# Altium project FMC-320U-B3.PrjPcb
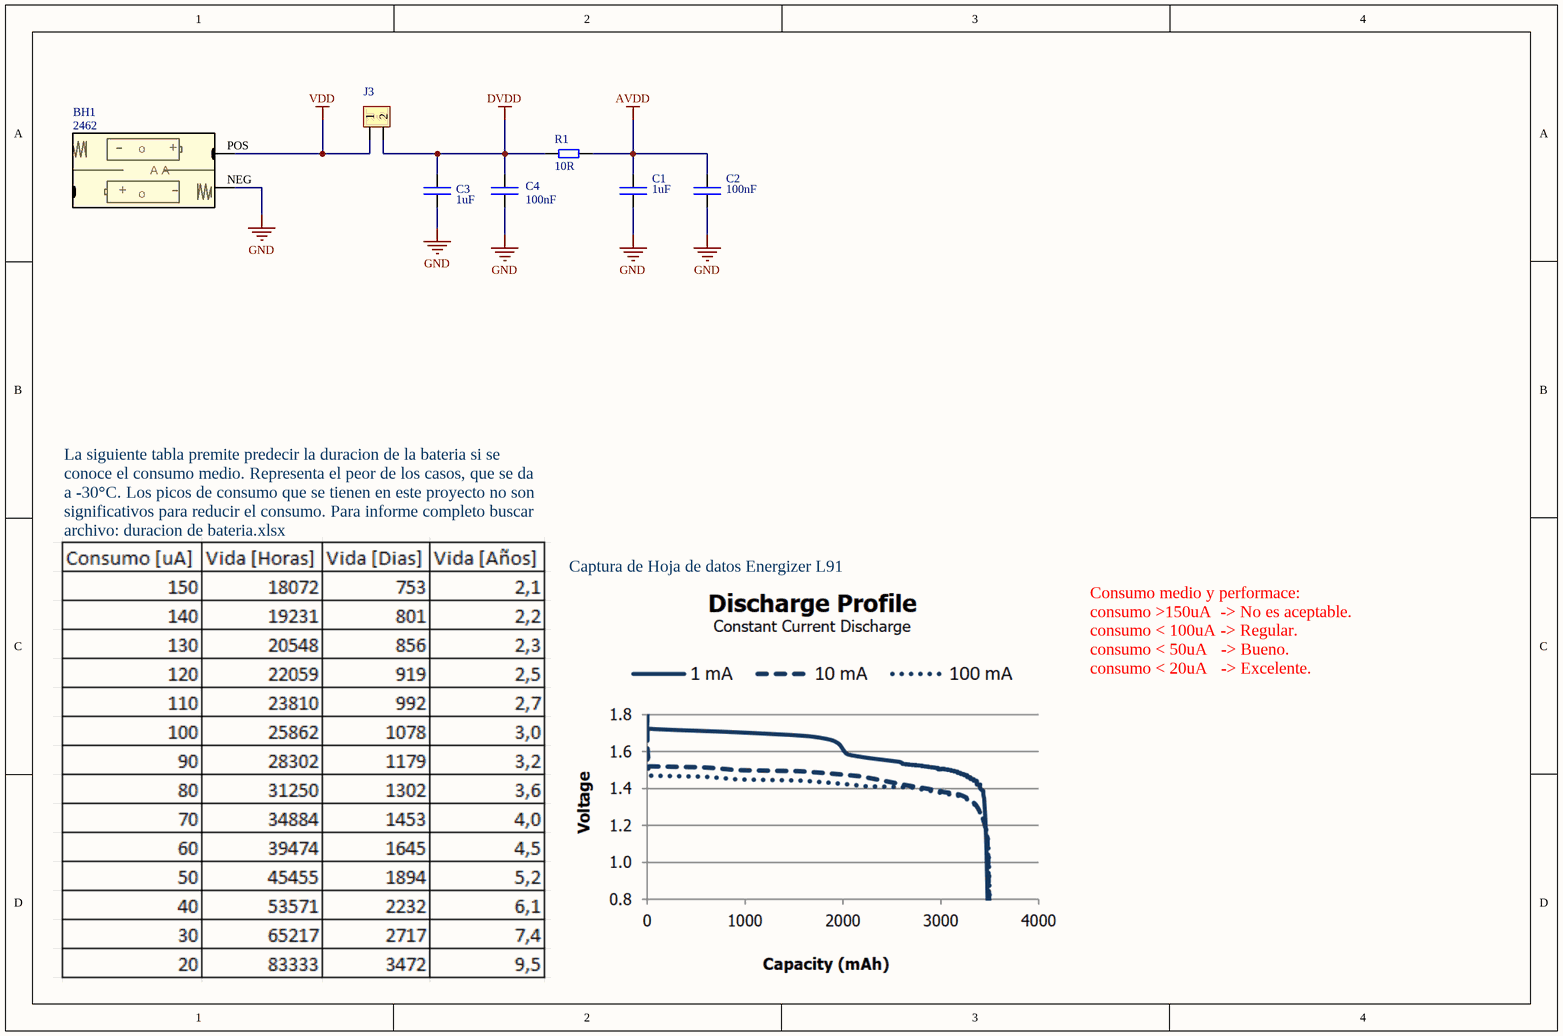
[diagram p0: BatteryMainSystem.SchDoc]
5 sheets, 58 parts. Net scope: flat (ports and power ports of the same name join across sheets).
Board file: FMC-320U-B3.PcbDoc
Sheets:
  BatteryMainSystem.SchDoc
  Interboard.SchDoc
  Fluid_Flow_FE.SchDoc
  Fluid_RTD_FE.SchDoc
  User_Terminal_Block.SchDoc

## Sheet BatteryMainSystem.SchDoc
size A4; SheetNumber: 1; SheetTotal: 4

### Parts
BH1  2462  [BATTERY_HOLDER_2XAA]
C1  1uF  [CAP_SM0603_YAGEOCC2_N]
C2  100nF  [CAP_SM0603_YAGEOCC2_N]
C3  1uF  [CAP_SM0603_YAGEOCC2_N]
C4  100nF  [CAP_SM0603_YAGEOCC2_N]
J3  54101-T0600LF-CUT-2  [HEADER PIN 1X2]  (value not drawn)
R1  10R  [RES_SM0603_YAGEORC_N]

### Nets
AVDD: C1.1 C2.1 R1.2
DVDD: C3.1 C4.1 J3.2 R1.1
GND: BH1.NEG C1.2 C2.2 C3.2 C4.2
VDD: BH1.POS J3.1

### Notes on the sheet
- La siguiente tabla premite predecir la duracion de la bateria si se conoce el consumo medio. Representa el peor de los casos, que se da a -30°C. Los picos de consumo que se tienen en este proyecto no son significativos para reducir el consumo. Para informe completo buscar archivo: duracion de bateria.xlsx
- Captura de Hoja de datos Energizer L91
- Consumo medio y performace:
  consumo >150uA  -> No es aceptable.
  consumo < 100uA -> Regular.
  consumo < 50uA   -> Bueno.
  consumo < 20uA   -> Excelente.
- Title:
- Size: A4
- Date:
- FMC-320U MODEL A
- Sheet:
- Time:
- Of:
- Version:
- Revision:
- Release:
- 1
- 0
- FLOWMEET SRL
- File
- (in symbol 2462) +; A A

### Library data of the parts
BH1 = 2462: Battery holder 2XAA TH; Manufacturer: Keystone; Manufacturer Part Number: 2462; Category: Battery holder; Datasheet: https://www.keyelco.com/userAssets/file/M65p28.pdf; Temperature Max: -; Temperature Min: -
C1 C3 = CC0603KRX7R6BB105: CAP 1uF SM0603 X7R 10V YAGEO CC2; Tolerance (%): 5; Voltage Rating (Volts): 50; Category: Capacitor; Manufacturer: Yageo; Manufacturer Part Number: CC0603KRX7R6BB105; Package: 0603; Value: 1uF; ComponentLink1URL: http://www.yageo.com; ComponentLink1Description: Manufacturer Website; Datasheet: https://datasheet.lcsc.com/lcsc/2304140030_YAGEO-CC0603KRX7R6BB105_C113807.pdf
C2 C4 = CC0603KRX7R9BB104: CAP 100nF SM0603 X7R 50V YAGEO CC2; Tolerance (%): 10; Voltage Rating (Volts): 50; Category: Capacitor; Manufacturer: Yageo; Manufacturer Part Number: CC0603KRX7R9BB104; Package: 0603; Value: 100nF; Supplier Part Number 1: 1362556; Supplier 1: Farnell; ComponentLink1URL: http://www.yageo.com; ComponentLink1Description: Manufacturer Website; Supplier 2: Digi-Key; Supplier Part Number 2: 311-1344-1-ND; Datasheet: https://datasheet.lcsc.com/lcsc/2211101700_YAGEO-CC0603KRX7R9BB104_C14663.pdf
J3 = 54101-T0600LF-CUT-2: Pin header pitch 2.54 TH - cuttable 2 od 36 positions.; Manufacturer: Amphenol ICC; Fraction: 2/36; Manufacturer Part Number: 54101-T0600LF; Vendor: *; Vendor Part Number: *
R1 = RC0603FR-0710RL: RES 10R SM0603 YAGEO RC_L; Power (Watts): 0.1; Resistance (Ohms): 10; Tolerance (%): 1; Category: Resistor; Manufacturer: Yageo; Manufacturer Part Number: RC0603FR-0710RL; Package: 0603; Value: 10R; Supplier Part Number 1: 9238247; Supplier 1: Farnell; ComponentLink1Description: Manufacturer Website; ComponentLink1URL: http://www.yageo.com; Supplier 2: Digi-Key; Supplier Part Number 2: 311-10.0HRCT-ND

## Sheet Interboard.SchDoc
size A4; SheetNumber: 2; SheetTotal: 5
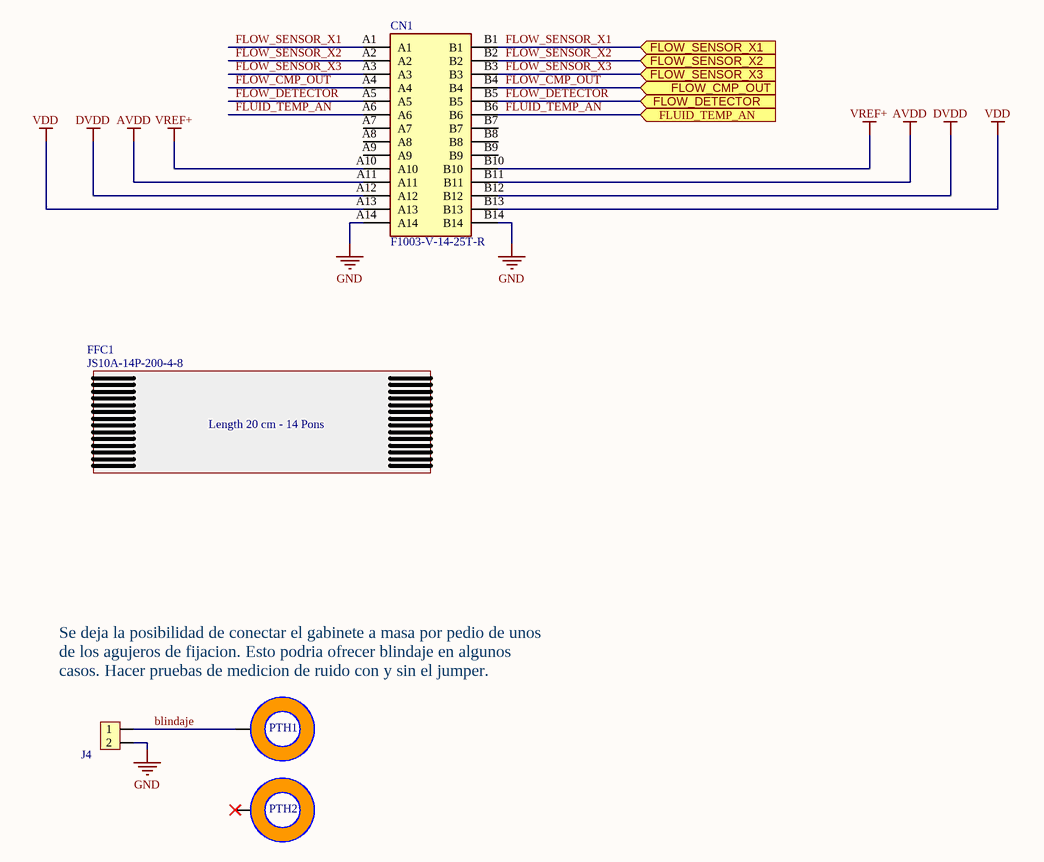
[diagram p1: Interboard.SchDoc]

### Parts
CN1  F1003-V-14-25T-R  [F1003-V-14-25T-R]
FFC1  JS10A-14P-200-4-8  [no_footprint]  (mechanical)
J4  54101-T0600LF-CUT-2  [HEADER PIN 1X2]  (value not drawn)
PTH1  PTH-3MM-L  [PTH_M3_L]  (value not drawn)  (no BOM)
PTH2  PTH-3MM-L  [PTH_M3_L]  (value not drawn)  (no BOM)

### Ports
FLOW_CMP_OUT (in), FLOW_DETECTOR (in), FLOW_SENSOR_X1 (in), FLOW_SENSOR_X2 (in), FLOW_SENSOR_X3 (in), FLUID_TEMP_AN (in)

### Nets
AVDD: CN1.A11 CN1.B11
DVDD: CN1.A12 CN1.B12
GND: CN1.A14 CN1.B14 J4.2
VDD: CN1.A13 CN1.B13
VREF+: CN1.A10 CN1.B10
blindaje: J4.1 PTH1.1
FLOW_CMP_OUT: CN1.A4 CN1.B4 ; port FLOW_CMP_OUT
FLOW_DETECTOR: CN1.A5 CN1.B5 ; port FLOW_DETECTOR
FLOW_SENSOR_X1: CN1.A1 CN1.B1 ; port FLOW_SENSOR_X1
FLOW_SENSOR_X2: CN1.A2 CN1.B2 ; port FLOW_SENSOR_X2
FLOW_SENSOR_X3: CN1.A3 CN1.B3 ; port FLOW_SENSOR_X3
FLUID_TEMP_AN: CN1.A6 CN1.B6 ; port FLUID_TEMP_AN

Not connected (* = marked no-connect by the designer): CN1 A7 A8 A9 B7 B8 B9; PTH2 1*

### Notes on the sheet
- Se deja la posibilidad de conectar el gabinete a masa por pedio de unos de los agujeros de fijacion. Esto podria ofrecer blindaje en algunos casos. Hacer pruebas de medicion de ruido con y sin el jumper.
- (in symbol JS10A-14P-200-4-8) Length 20 cm - 14 Pons

### Library data of the parts
CN1 = F1003-V-14-25T-R: 14 Position FFC, FPC Connector Contacts, Vertical - 1 Sided 0.039" (1.00mm) Surface Mount; Manufacturer: XFCN; Vendor Part Number: C2764805; Vendor: LCSC; Manufacturer Part Number: F1003-V-14-25T-R
FFC1 = JS10A-14P-200-4-8: Length 20 cm - 14 Pons - FFC flat flexible cable; Manufacturer: JXTCONN; Vendor Part Number: C2857589; Vendor: LCSC; PCBA: Off-board cable/wire – no PCB footprint. Please source and include in PCBA assembly; Manufacturer Part Number: JS10A-14P-200-4-8
J4 = 54101-T0600LF-CUT-2: as J3 on sheet BatteryMainSystem; Manufacturer Part Number: 54101-T0600LF; Vendor: *; Vendor Part Number: *
PTH1 PTH2 = PTH-3MM-L: Montaje M3. algo de holgura y buena corona.; Category: Mounting Hole; Temperature Max: -; Temperature Min: -

## Sheet Fluid_Flow_FE.SchDoc
size A4; SheetNumber: 3; SheetTotal: 5
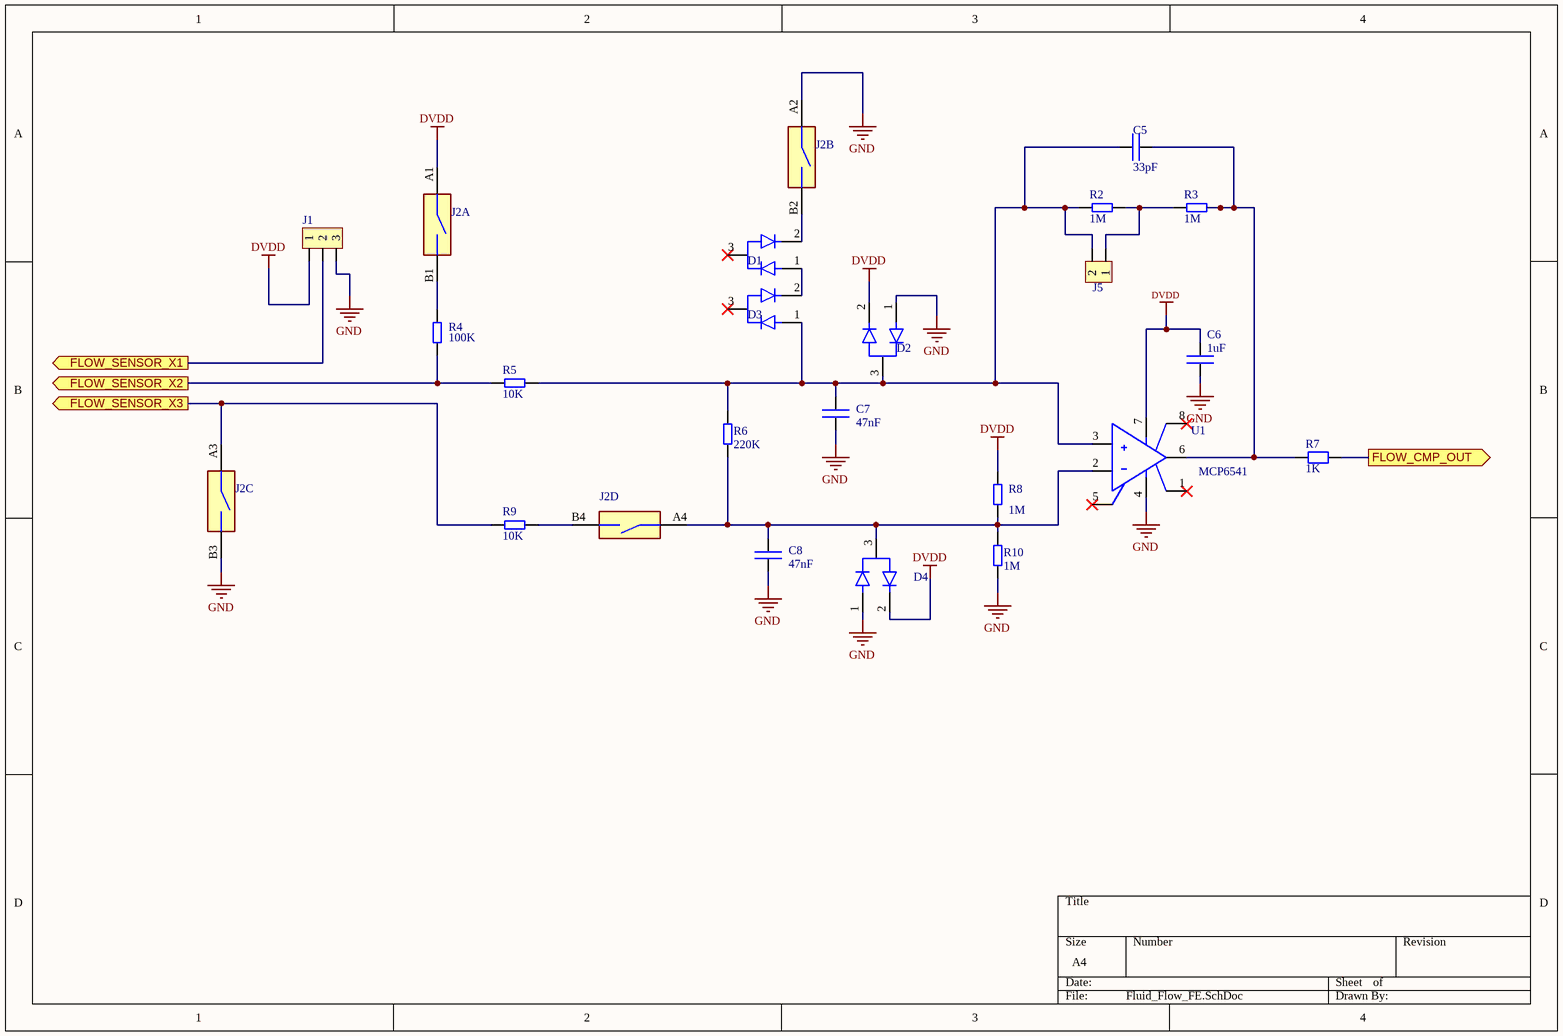
[diagram p2: Fluid_Flow_FE.SchDoc]

### Parts
C5  33pF  [CAP_SM0603_YAGEOCC2_N]
C6  1uF  [CAP_SM0603_YAGEOCC2_N]
C7  47nF  [CAP_SM0603_YAGEOCC2_N]
C8  47nF  [CAP_SM0603_YAGEOCC2_N]
D1  BAV23S  [BAV23S]  (value not drawn)
D2  BAV23S  [BAV23S]  (value not drawn)
D3  BAV23S  [BAV23S]  (value not drawn)
D4  BAV23S  [BAV23S]  (value not drawn)
J1  54101-T0600LF-CUT-3  [HEADER PIN 1X3]  (value not drawn)
J2  DSHP04TSGER_1  [DSHP04TSGER]  (value not drawn)  (parts A,B,C,D of 4)
J5  54101-T0600LF-CUT-2  [HEADER PIN 1X2]  (value not drawn)
R2  1M  [RES_SM0603_YAGEORC_N]
R3  1M  [RES_SM0603_YAGEORC_N]
R4  100K  [RES_SM0603_YAGEORC_N]
R5  10K  [RES_SM0603_YAGEORC_N]
R6  220K  [RES_SM0603_YAGEORC_N]
R7  1K  [RES_SM0603_YAGEORC_N]
R8  1M  [RES_SM0603_YAGEORC_N]
R9  10K  [RES_SM0603_YAGEORC_N]
R10  1M  [RES_SM0603_YAGEORC_N]
U1  MCP6541  [MCP6541-E/SN]

### Ports
FLOW_CMP_OUT (out), FLOW_SENSOR_X1 (out), FLOW_SENSOR_X2 (out), FLOW_SENSOR_X3 (out)

### Nets
DVDD: C6.1 D2.2 D4.2 J1.1 J2.A1 R8.2 U1.7(V+)
GND: C6.2 C7.2 C8.2 D2.1 D4.1 J1.3 J2.A2 J2.B3 R10.1 U1.4(V-)
FLOW_CMP_OUT: R7.2 ; port FLOW_CMP_OUT
FLOW_SENSOR_X1: J1.2 ; port FLOW_SENSOR_X1
FLOW_SENSOR_X2: R4.1 R5.1 ; port FLOW_SENSOR_X2
FLOW_SENSOR_X3: J2.A3 R9.1 ; port FLOW_SENSOR_X3
NetC5_1: C5.1 C7.1 D2.3 D3.1 J5.2 R2.1 R5.2 R6.2 U1.3(IN+)
NetC5_2: C5.2 R3.2 R7.1 U1.6(OUT)
NetC8_1: C8.1 D4.3 J2.A4 R6.1 R8.1 R10.2 U1.2(IN-)
NetD1_1: D1.1 D3.2
NetD1_2: D1.2 J2.B2
NetJ2_B1: J2.B1 R4.2
NetJ2_B4: J2.B4 R9.2
NetJ5_1: J5.1 R2.2 R3.1

Not connected (* = marked no-connect by the designer): D1 3*; D3 3*; U1 1(OS_NUL)* 5(OS_NUL)* 8(TAB)*

### Library data of the parts
C5 = CC0603JRNPO9BN330: CAP 33pF SM0603 NPO 50V YAGEO CC2; Tolerance (%): 5; Voltage Rating (Volts): 50; Category: Capacitor; Manufacturer: Yageo; Manufacturer Part Number: CC0603JRNPO9BN330; Package: 0603; Value: 33pF; Supplier Part Number 1: 722029; Supplier 1: Farnell; ComponentLink1URL: http://www.yageo.com; ComponentLink1Description: Manufacturer Website; Supplier 2: Digi-Key; Supplier Part Number 2: 311-1064-1-ND
C6 = CC0603KRX7R6BB105: as C1 on sheet BatteryMainSystem; Category: Capacitor; Manufacturer: Yageo; Manufacturer Part Number: CC0603KRX7R6BB105; Package: 0603; Value: 1uF; ComponentLink1URL: http://www.yageo.com; ComponentLink1Description: Manufacturer Website; Datasheet: https://datasheet.lcsc.com/lcsc/2304140030_YAGEO-CC0603KRX7R6BB105_C113807.pdf
C7 C8 = CC0603JRX7R7BB473: CAP 47nF SM0603 X7R 16V YAGEO; Tolerance: 5; Category: Capacitor; Manufacturer: Yageo; Manufacturer Part Number: CC0603JRX7R7BB473; Package: 0603; Value: 47nF; ComponentLink1URL: http://www.yageo.com; ComponentLink1Description: Manufacturer Website
D1-D4 = BAV23S: DIODE ARRAY GP 250V 200MA SOT23; Manufacturer: onsemi; Manufacturer Part Number: BAV23S; Category: Diodo; Datasheet: https://www.onsemi.com/pdf/datasheet/bav23s-d.pdf; Temperature Max: 150; Temperature Min: -55
J1 = 54101-T0600LF-CUT-3: Pin header pitch 2.54 TH - cuttable 3 od 36 positions.; Manufacturer: Amphenol ICC; Fraction: 3/36; Manufacturer Part Number: 54101-T0600LF; Vendor: *; Vendor Part Number: *
J2 = DSHP04TSGER_1: DIP Switches / SIP Switches 4pos 0.025A 24VDC 1/2 Pitch; Manufacturer: Kangshen; Vendor Part Number: C3293144; Vendor: LCSC; Manufacturer Part Number: DSHP04TSGER
J5 = 54101-T0600LF-CUT-2: as J3 on sheet BatteryMainSystem; Manufacturer Part Number: 54101-T0600LF; Vendor: *; Vendor Part Number: *
R2 R3 R8 R10 = RC0603FR-071ML: RES 1M SM0603 YAGEO RC_L; Power (Watts): 0.1; Resistance (Ohms): 1000000; Tolerance (%): 1; Category: Resistor; Manufacturer: Yageo; Manufacturer Part Number: RC0603FR-071ML; Package: 0603; Value: 1M; Supplier Part Number 1: 9238840; Supplier 1: Farnell; ComponentLink1URL: http://www.yageo.com; ComponentLink1Description: Manufacturer Website; Supplier 2: Digi-Key; Supplier Part Number 2: 311-1.00MHRCT-ND; Datasheet: https://www.yageo.com/upload/media/product/productsearch/datasheet/rchip/PYu-RC_Group_51_RoHS_L_12.pdf
R4 = RC0603FR-13100KL: RES 100K SM0603 YAGEO RC_L; Power (Watts): 0.1; Resistance (Ohms): 100000; Tolerance (%): 1; Category: Resistor; Manufacturer: Yageo; Manufacturer Part Number: RC0603FR-13100KL; Package: 0603; Value: 100K; Supplier Part Number 1: 2309107; Supplier 1: Farnell; ComponentLink1Description: Manufacturer Website; ComponentLink1URL: http://www.yageo.com; Supplier 2: Digi-Key
R5 R9 = RC0603FR-0710KL: RES 10K SM0603 YAGEO RC_L; Power (Watts): 0.1; Resistance (Ohms): 10000; Tolerance (%): 1; Category: Resistor; Manufacturer: Yageo; Manufacturer Part Number: RC0603FR-0710KL; Package: 0603; Value: 10K; Supplier Part Number 1: 9238603; Supplier 1: Farnell; ComponentLink1Description: Manufacturer Website; ComponentLink1URL: http://www.yageo.com; Supplier 2: Digi-Key; Supplier Part Number 2: 311-10.0KHRCT-ND
R6 = RC0603FR-07220KL: RES 220K SM0603 YAGEO RC_L; Power (Watts): 0.1; Resistance (Ohms): 220000; Tolerance (%): 1; Category: Resistor; Manufacturer: Yageo; Manufacturer Part Number: RC0603FR-07220KL; Package: 0603; Value: 220K; Supplier Part Number 1: 9238760; Supplier 1: Farnell; ComponentLink1Description: Manufacturer Website; ComponentLink1URL: http://www.yageo.com; Supplier 2: Digi-Key; Supplier Part Number 2: 311-220KHRCT-ND
R7 = RC0603FR-071KL: RES 1K SM0603 YAGEO RC_L; Power (Watts): 0.1; Resistance (Ohms): 1000; Tolerance (%): 1; Category: Resistor; Manufacturer: Yageo; Manufacturer Part Number: RC0603FR-071KL; Package: 0603; Value: 1K; Supplier Part Number 1: 9238484; Supplier 1: Farnell; ComponentLink1URL: http://www.yageo.com; ComponentLink1Description: Manufacturer Website; Supplier 2: Digi-Key; Supplier Part Number 2: 311-1.00KHRCT-ND
U1 = MCP6541-E/SN: IC COMP PP I/O SNGL 1.6V 8SOIC; Manufacturer: Microchip Tech; Manufacturer Part Number: MCP6541-E/SN

## Sheet Fluid_RTD_FE.SchDoc
size A4; SheetNumber: 4; SheetTotal: 5
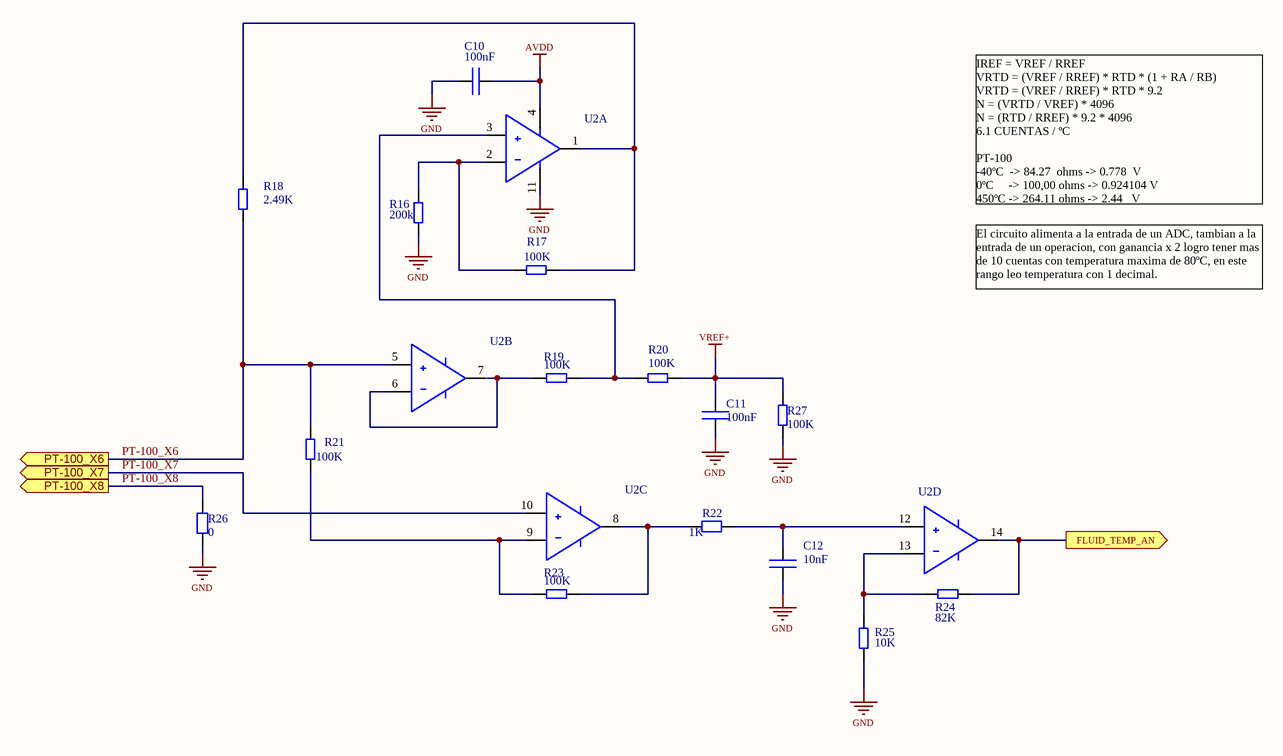
[diagram p3: Fluid_RTD_FE.SchDoc]

### Parts
C10  100nF  [CAP_SM0603_YAGEOCC2_N]
C11  100nF  [CAP_SM0603_YAGEOCC2_N]
C12  10nF  [CAP_SM0603_YAGEOCC2_N]
R16  200k  [RES_SM0603_YAGEORC_N]
R17  100K  [RES_SM0603_YAGEORC_N]
R18  2.49K  [RES_SM0603_YAGEORC_N]
R19  100K  [RES_SM0603_YAGEORC_N]
R20  100K  [RES_SM0603_YAGEORC_N]
R21  100K  [RES_SM0603_YAGEORC_N]
R22  1K  [RES_SM0603_YAGEORC_N]
R23  100K  [RES_SM0603_YAGEORC_N]
R24  82K  [RES_SM0603_YAGEORC_N]
R25  10K  [RES_SM0603_YAGEORC_N]
R26  0  [RES_SM0603_YAGEORC_N]
R27  100K  [RES_SM0603_YAGEORC_N]
U2  GS8044  [GS8044-SR]  (value not drawn)  (parts A,B,C,D of 4)

### Ports
FLUID_TEMP_AN (out), PT-100_X6 (out), PT-100_X7 (out), PT-100_X8 (out)

### Nets
AVDD: C10.1 U2.4(V+)
GND: C10.2 C11.2 C12.2 R16.1 R25.1 R26.1 R27.1 U2.11(GND)
VREF+: C11.1 R20.2 R27.2
FLUID_TEMP_AN: R24.2 U2.14(OUT) ; port FLUID_TEMP_AN
PT-100_X6: R18.1 R21.2 U2.5(IN+) ; port PT-100_X6
PT-100_X7: U2.10(IN+) ; port PT-100_X7
PT-100_X8: R26.2 ; port PT-100_X8
NetC12_1: C12.1 R22.2 U2.12(IN+)
NetR16_2: R16.2 R17.1 U2.2(IN-)
NetR17_2: R17.2 R18.2
NetR19_1: R19.1 U2.6(IN-)
NetR19_2: R19.2 R20.1 U2.3(IN+)
NetR21_1: R21.1 R23.1 U2.9(IN-)
NetR22_1: R22.1 R23.2 U2.8(OUT)
NetR24_1: R24.1 R25.2 U2.13(IN-)

Not connected (* = marked no-connect by the designer): U2 1(OUT) 7(OUT)

### Notes on the sheet
- IREF = VREF / RREF
  VRTD = (VREF / RREF) * RTD * (1 + RA / RB)
  VRTD = (VREF / RREF) * RTD * 9.2
  N = (VRTD / VREF) * 4096
  N = (RTD / RREF) * 9.2 * 4096
  6.1 CUENTAS / ºC
  PT-100
  -40ºC  -> 84.27  ohms -> 0.778  V
  0ºC     -> 100,00 ohms -> 0.924104 V
  450ºC -> 264.11 ohms -> 2.44   V
- El circuito alimenta a la entrada de un ADC, tambian a la entrada de un operacion, con ganancia x 2 logro tener mas de 10 cuentas con temperatura maxima de 80ºC, en este rango leo temperatura con 1 decimal.

### Library data of the parts
C10 C11 = CC0603KRX7R9BB104: as C2 on sheet BatteryMainSystem; Category: Capacitor; Manufacturer: Yageo; Manufacturer Part Number: CC0603KRX7R9BB104; Package: 0603; Value: 100nF; Supplier Part Number 1: 1362556; Supplier 1: Farnell; ComponentLink1URL: http://www.yageo.com; ComponentLink1Description: Manufacturer Website; Supplier 2: Digi-Key; Supplier Part Number 2: 311-1344-1-ND; Datasheet: https://datasheet.lcsc.com/lcsc/2211101700_YAGEO-CC0603KRX7R9BB104_C14663.pdf
C12 = CC0603KRX7R9BB103: CAP 10nF SM0603 X7R 50V YAGEO CC2; Tolerance (%): 10; Voltage Rating (Volts): 50; Category: Capacitor; Manufacturer: Yageo; Manufacturer Part Number: CC0603KRX7R9BB103; Package: 0603; Value: 10nF; Supplier Part Number 1: 722236; Supplier 1: Farnell; ComponentLink1URL: http://www.yageo.com; ComponentLink1Description: Manufacturer Website; Supplier 2: Digi-Key; Supplier Part Number 2: 311-1085-1-ND
R16 = RC0603FR-07200KL: RES 200K SM0603 YAGEO RC_L; Power (Watts): 0.1; Resistance (Ohms): 200000; Tolerance (%): 1; Category: Resistor; Manufacturer: Yageo; Manufacturer Part Number: RC0603FR-07200KL; Package: 0603; Value: 200k; ComponentLink1URL: http://www.yageo.com; ComponentLink1Description: Manufacturer Website
R17 R19-R21 R23 R27 = RC0603FR-13100KL: as R4 on sheet Fluid_Flow_FE; Category: Resistor; Manufacturer: Yageo; Manufacturer Part Number: RC0603FR-13100KL; Package: 0603; Value: 100K; Supplier Part Number 1: 2309107; Supplier 1: Farnell; ComponentLink1Description: Manufacturer Website; ComponentLink1URL: http://www.yageo.com; Supplier 2: Digi-Key
R18 = RC0603FR-072K49L: RES 2K49 SM0603 YAGEO RC_L; Power (Watts): 0.1; Resistance (Ohms): 2490; Tolerance (%): 1; Category: Resistor; Manufacturer: Yageo; Manufacturer Part Number: RC0603FR-072K49L; Package: 0603; Value: 2.49K; ComponentLink1URL: http://www.yageo.com; ComponentLink1Description: Manufacturer Website; Datasheet: https://www.yageo.com/upload/media/product/app/datasheet/rchip/pyu-rc_group_51_rohs_l.pdf
R22 = RC0603FR-071KL: as R7 on sheet Fluid_Flow_FE; Category: Resistor; Manufacturer: Yageo; Manufacturer Part Number: RC0603FR-071KL; Package: 0603; Value: 1K; Supplier Part Number 1: 9238484; Supplier 1: Farnell; ComponentLink1URL: http://www.yageo.com; ComponentLink1Description: Manufacturer Website; Supplier 2: Digi-Key; Supplier Part Number 2: 311-1.00KHRCT-ND
R24 = RC0603FR-0782KL: RES 82K SM0603 YAGEO RC_L; Power (Watts): 0.1; Resistance (Ohms): 82000; Tolerance (%): 1; Category: Resistor; Manufacturer: Yageo; Manufacturer Part Number: RC0603FR-0782KL; Package: 0603; Value: 82K; Supplier Part Number 1: 9238719; Supplier 1: Farnell; ComponentLink1Description: Manufacturer Website; ComponentLink1URL: http://www.yageo.com; Supplier 2: Digi-Key; Supplier Part Number 2: 311-82.0KHRCT-ND
R25 = RC0603FR-0710KL: as R5 on sheet Fluid_Flow_FE; Category: Resistor; Manufacturer: Yageo; Manufacturer Part Number: RC0603FR-0710KL; Package: 0603; Value: 10K; Supplier Part Number 1: 9238603; Supplier 1: Farnell; ComponentLink1Description: Manufacturer Website; ComponentLink1URL: http://www.yageo.com; Supplier 2: Digi-Key; Supplier Part Number 2: 311-10.0KHRCT-ND
R26 = RC0603FR-070RL: RES 0 OHMS SM0603 YAGEO RC_L; Power (Watts): 0.1; Tolerance (%): 1; Category: Resistor; Manufacturer: Yageo; Manufacturer Part Number: RC0603FR-070RL; Package: 0603; Resistance (Ohms): 0; Value: 0; Supplier Part Number 1: 9238484; Supplier 1: Farnell; ComponentLink1URL: http://www.yageo.com; ComponentLink1Description: Manufacturer Website; Supplier 2: Digi-Key; Supplier Part Number 2: 311-1.00KHRCT-ND; Datasheet: https://www.yageo.com/upload/media/product/app/datasheet/rchip/pyu-rc_group_51_rohs_l.pdf
U2 = GS8044-SR: IC OPAMP GP 4 CIRCUIT 14SOIC; Manufacturer: Gainsil; Vendor: LCSC; Manufacturer Part Number: GS8044-SR; Vendor Part Number: *

## Sheet User_Terminal_Block.SchDoc
size A4; SheetNumber: 3; SheetTotal: 4
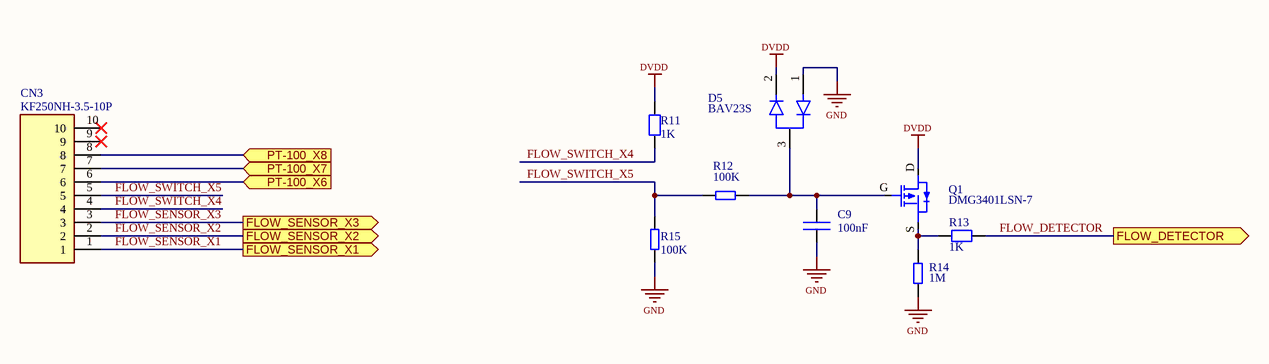
[diagram p4: User_Terminal_Block.SchDoc]

### Parts
C9  100nF  [CAP_SM0603_YAGEOCC2_N]
CN3  KF250NH-3.5-10P  [KF250NH-3.5-10P]
D5  BAV23S  [BAV23S]
Q1  DMG3401LSN-7  [DMG3401LSN-7]
R11  1K  [RES_SM0603_YAGEORC_N]
R12  100K  [RES_SM0603_YAGEORC_N]
R13  1K  [RES_SM0603_YAGEORC_N]
R14  1M  [RES_SM0603_YAGEORC_N]
R15  100K  [RES_SM0603_YAGEORC_N]

### Ports
FLOW_DETECTOR (out), FLOW_SENSOR_X1 (out), FLOW_SENSOR_X2 (out), FLOW_SENSOR_X3 (out), PT-100_X6 (in), PT-100_X7 (in), PT-100_X8 (in)

### Nets
DVDD: D5.2 Q1.D R11.2
GND: C9.2 D5.1 R14.1 R15.1
FLOW_DETECTOR: R13.2 ; port FLOW_DETECTOR
FLOW_SENSOR_X1: CN3.1 ; port FLOW_SENSOR_X1
FLOW_SENSOR_X2: CN3.2 ; port FLOW_SENSOR_X2
FLOW_SENSOR_X3: CN3.3 ; port FLOW_SENSOR_X3
FLOW_SWITCH_X4: CN3.4 R11.1
FLOW_SWITCH_X5: CN3.5 R12.1 R15.2
PT-100_X6: CN3.6 ; port PT-100_X6
PT-100_X7: CN3.7 ; port PT-100_X7
PT-100_X8: CN3.8 ; port PT-100_X8
NetC9_1: C9.1 D5.3 Q1.G R12.2
NetQ1_S: Q1.S R13.1 R14.2

Not connected (* = marked no-connect by the designer): CN3 9* 10*

### Library data of the parts
C9 = CC0603KRX7R9BB104: as C2 on sheet BatteryMainSystem; Category: Capacitor; Manufacturer: Yageo; Manufacturer Part Number: CC0603KRX7R9BB104; Package: 0603; Value: 100nF; Supplier Part Number 1: 1362556; Supplier 1: Farnell; ComponentLink1URL: http://www.yageo.com; ComponentLink1Description: Manufacturer Website; Supplier 2: Digi-Key; Supplier Part Number 2: 311-1344-1-ND; Datasheet: https://datasheet.lcsc.com/lcsc/2211101700_YAGEO-CC0603KRX7R9BB104_C14663.pdf
CN3 = KF250NH-3.5-10P: PCB Terminal Block 1752188; Manufacturer: cixi_kefa_elec; Vendor Part Number: C976564; Vendor: LCSC; Manufacturer Part Number: KF250NH-3.5-10P; Price: 1.22
D5 = BAV23S: as D1 on sheet Fluid_Flow_FE; Manufacturer Part Number: BAV23S; Category: Diodo; Datasheet: https://www.onsemi.com/pdf/datasheet/bav23s-d.pdf; Temperature Max: 150; Temperature Min: -55
Q1 = DMG3401LSN-7: P-CHANNEL ENHANCEMENT MODE MOSFET / RDS(ON) = 85mΩ @ VGS = -2.5V -> ID -2.7A / V(BR)DDS 30V; Manufacturer: Diodes Incorporated; Category: Transistor mosfet; Manufacturer Part Number: DMG3401LSN-7; Datasheet: https://www.diodes.com/assets/Datasheets/DMG3401LSN.pdf; Temperature Max: 150; Temperature Min: -55
R11 R13 = RC0603FR-071KL: as R7 on sheet Fluid_Flow_FE; Category: Resistor; Manufacturer: Yageo; Manufacturer Part Number: RC0603FR-071KL; Package: 0603; Value: 1K; Supplier Part Number 1: 9238484; Supplier 1: Farnell; ComponentLink1Description: Manufacturer Website; ComponentLink1URL: http://www.yageo.com; Supplier 2: Digi-Key; Supplier Part Number 2: 311-1.00KHRCT-ND
R12 R15 = RC0603FR-13100KL: as R4 on sheet Fluid_Flow_FE; Category: Resistor; Manufacturer: Yageo; Manufacturer Part Number: RC0603FR-13100KL; Package: 0603; Value: 100K; Supplier Part Number 1: 2309107; Supplier 1: Farnell; ComponentLink1Description: Manufacturer Website; ComponentLink1URL: http://www.yageo.com; Supplier 2: Digi-Key
R14 = RC0603FR-071ML: as R2 on sheet Fluid_Flow_FE; Category: Resistor; Manufacturer: Yageo; Manufacturer Part Number: RC0603FR-071ML; Package: 0603; Value: 1M; Supplier Part Number 1: 9238840; Supplier 1: Farnell; ComponentLink1URL: http://www.yageo.com; ComponentLink1Description: Manufacturer Website; Supplier 2: Digi-Key; Supplier Part Number 2: 311-1.00MHRCT-ND; Datasheet: https://www.yageo.com/upload/media/product/productsearch/datasheet/rchip/PYu-RC_Group_51_RoHS_L_12.pdf

## Nets that join several sheets
AVDD: BatteryMainSystem (C1.1 C2.1 R1.2), Interboard (CN1.A11 CN1.B11), Fluid_RTD_FE (C10.1 U2.4)
DVDD: BatteryMainSystem (C3.1 C4.1 J3.2 R1.1), Interboard (CN1.A12 CN1.B12), Fluid_Flow_FE (7 pins), User_Terminal_Block (D5.2 Q1.D R11.2)
GND: BatteryMainSystem (5 pins), Interboard (CN1.A14 CN1.B14 J4.2), Fluid_Flow_FE (10 pins), Fluid_RTD_FE (8 pins), User_Terminal_Block (C9.2 D5.1 R14.1 R15.1)
VDD: BatteryMainSystem (BH1.POS J3.1), Interboard (CN1.A13 CN1.B13)
VREF+: Interboard (CN1.A10 CN1.B10), Fluid_RTD_FE (C11.1 R20.2 R27.2)
FLOW_CMP_OUT: Interboard (CN1.A4 CN1.B4), Fluid_Flow_FE (R7.2)
FLOW_DETECTOR: Interboard (CN1.A5 CN1.B5), User_Terminal_Block (R13.2)
FLOW_SENSOR_X1: Interboard (CN1.A1 CN1.B1), Fluid_Flow_FE (J1.2), User_Terminal_Block (CN3.1)
FLOW_SENSOR_X2: Interboard (CN1.A2 CN1.B2), Fluid_Flow_FE (R4.1 R5.1), User_Terminal_Block (CN3.2)
FLOW_SENSOR_X3: Interboard (CN1.A3 CN1.B3), Fluid_Flow_FE (J2.A3 R9.1), User_Terminal_Block (CN3.3)
FLUID_TEMP_AN: Interboard (CN1.A6 CN1.B6), Fluid_RTD_FE (R24.2 U2.14)
PT-100_X6: Fluid_RTD_FE (R18.1 R21.2 U2.5), User_Terminal_Block (CN3.6)
PT-100_X7: Fluid_RTD_FE (U2.10), User_Terminal_Block (CN3.7)
PT-100_X8: Fluid_RTD_FE (R26.2), User_Terminal_Block (CN3.8)